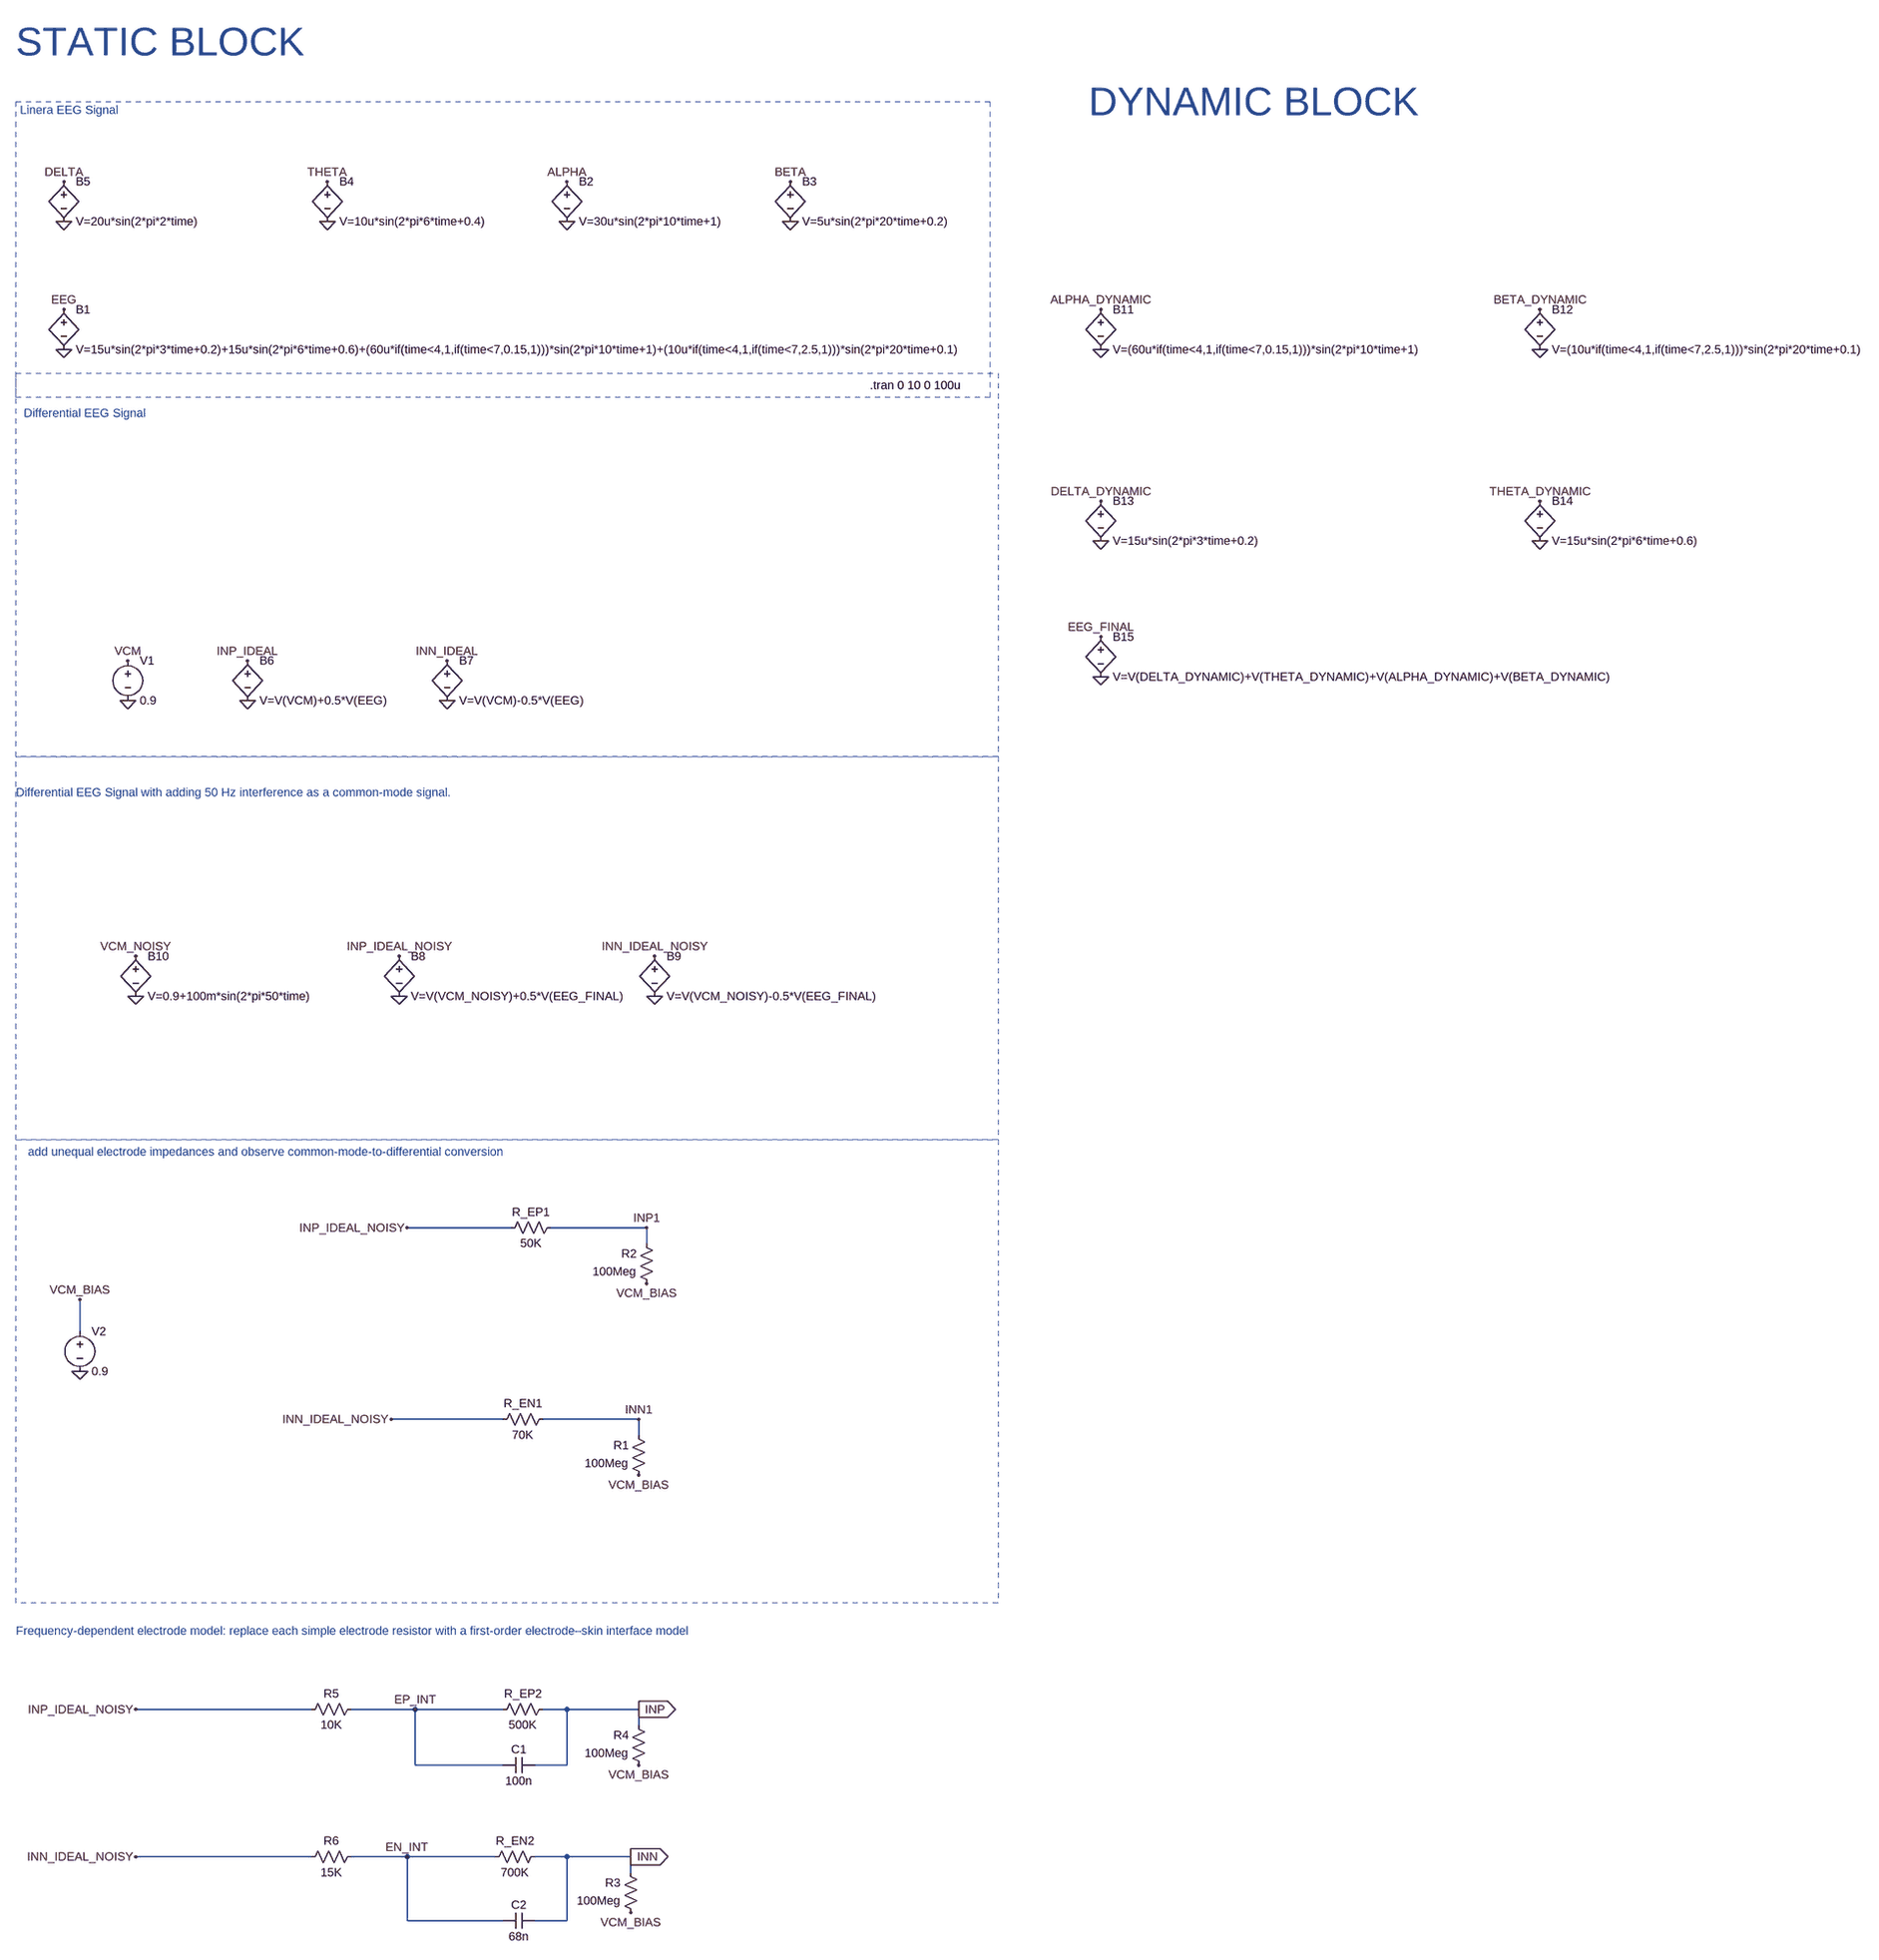
[diagram p0: schematic EEG_INPUT_MODEL.asc]
EEG_INPUT_MODEL.asc, the LTspice schematic file:
Version 4.1
SHEET 1 880 1832
WIRE -4880 112 -5088 112
WIRE -4608 112 -4800 112
WIRE -4608 144 -4608 112
WIRE -5744 320 -5744 256
WIRE -4896 496 -5120 496
WIRE -4624 496 -4816 496
WIRE -4624 528 -4624 496
WIRE -5280 1152 -5632 1152
WIRE -5072 1152 -5200 1152
WIRE -4896 1152 -5072 1152
WIRE -4768 1152 -4816 1152
WIRE -4624 1152 -4768 1152
WIRE -4624 1184 -4624 1152
WIRE -5072 1264 -5072 1152
WIRE -4896 1264 -5072 1264
WIRE -4768 1264 -4768 1152
WIRE -4768 1264 -4832 1264
WIRE -5280 1536 -5632 1536
WIRE -5088 1536 -5200 1536
WIRE -4912 1536 -5088 1536
WIRE -4768 1536 -4832 1536
WIRE -4640 1536 -4768 1536
WIRE -4640 1568 -4640 1536
WIRE -5088 1664 -5088 1536
WIRE -4896 1664 -5088 1664
WIRE -4768 1664 -4768 1536
WIRE -4768 1664 -4832 1664
FLAG -5776 -1648 0
FLAG -5776 -1728 EEG
FLAG -4768 -1904 0
FLAG -4768 -1984 ALPHA
FLAG -4320 -1904 0
FLAG -4320 -1984 BETA
FLAG -5248 -1904 0
FLAG -5248 -1984 THETA
FLAG -5776 -1904 0
FLAG -5776 -1984 DELTA
FLAG -5648 -944 0
FLAG -5648 -1024 VCM
FLAG -5408 -944 0
FLAG -5408 -1024 INP_IDEAL
FLAG -5008 -944 0
FLAG -5008 -1024 INN_IDEAL
FLAG -5104 -352 0
FLAG -5104 -432 INP_IDEAL_NOISY
FLAG -4592 -352 0
FLAG -4592 -432 INN_IDEAL_NOISY
FLAG -5632 -352 0
FLAG -5632 -432 VCM_NOISY
FLAG -5088 112 INP_IDEAL_NOISY
FLAG -5120 496 INN_IDEAL_NOISY
FLAG -5744 400 0
FLAG -5744 256 VCM_BIAS
FLAG -4608 112 INP1
FLAG -4624 496 INN1
FLAG -4608 224 VCM_BIAS
FLAG -4624 608 VCM_BIAS
FLAG -5632 1152 INP_IDEAL_NOISY
FLAG -5632 1536 INN_IDEAL_NOISY
FLAG -4624 1152 INP
IOPIN -4624 1152 Out
FLAG -4640 1536 INN
IOPIN -4640 1536 Out
FLAG -4624 1264 VCM_BIAS
FLAG -4640 1648 VCM_BIAS
FLAG -5072 1152 EP_INT
FLAG -5088 1536 EN_INT
FLAG -2656 -1648 0
FLAG -2656 -1728 ALPHA_DYNAMIC
FLAG -1776 -1648 0
FLAG -1776 -1728 BETA_DYNAMIC
FLAG -2656 -1264 0
FLAG -2656 -1344 DELTA_DYNAMIC
FLAG -1776 -1264 0
FLAG -1776 -1344 THETA_DYNAMIC
FLAG -2656 -992 0
FLAG -2656 -1072 EEG_FINAL
SYMBOL bv -5776 -1744 R0
SYMATTR InstName B1
SYMATTR Value V=15u*sin(2*pi*3*time+0.2)+15u*sin(2*pi*6*time+0.6)+(60u*if(time<4,1,if(time<7,0.15,1)))*sin(2*pi*10*time+1)+(10u*if(time<4,1,if(time<7,2.5,1)))*sin(2*pi*20*time+0.1)
SYMBOL bv -4768 -2000 R0
SYMATTR InstName B2
SYMATTR Value V=30u*sin(2*pi*10*time+1)
SYMBOL bv -4320 -2000 R0
SYMATTR InstName B3
SYMATTR Value V=5u*sin(2*pi*20*time+0.2)
SYMBOL bv -5248 -2000 R0
SYMATTR InstName B4
SYMATTR Value V=10u*sin(2*pi*6*time+0.4)
SYMBOL bv -5776 -2000 R0
SYMATTR InstName B5
SYMATTR Value V=20u*sin(2*pi*2*time)
SYMBOL voltage -5648 -1040 R0
WINDOW 123 0 0 Left 0
WINDOW 39 0 0 Left 0
SYMATTR InstName V1
SYMATTR Value 0.9
SYMBOL bv -5408 -1040 R0
SYMATTR InstName B6
SYMATTR Value V=V(VCM)+0.5*V(EEG)
SYMBOL bv -5008 -1040 R0
SYMATTR InstName B7
SYMATTR Value V=V(VCM)-0.5*V(EEG)
SYMBOL bv -5104 -448 R0
SYMATTR InstName B8
SYMATTR Value V=V(VCM_NOISY)+0.5*V(EEG_FINAL)
SYMBOL bv -4592 -448 R0
SYMATTR InstName B9
SYMATTR Value V=V(VCM_NOISY)-0.5*V(EEG_FINAL)
SYMBOL bv -5632 -448 R0
SYMATTR InstName B10
SYMATTR Value V=0.9+100m*sin(2*pi*50*time)
SYMBOL res -4784 96 R90
WINDOW 0 0 56 VBottom 2
WINDOW 3 32 56 VTop 2
SYMATTR InstName R_EP1
SYMATTR Value 50K
SYMBOL res -4800 480 R90
WINDOW 0 0 56 VBottom 2
WINDOW 3 32 56 VTop 2
SYMATTR InstName R_EN1
SYMATTR Value 70K
SYMBOL voltage -5744 304 R0
WINDOW 123 0 0 Left 0
WINDOW 39 0 0 Left 0
SYMATTR InstName V2
SYMATTR Value 0.9
SYMBOL res -4608 624 R180
WINDOW 0 36 76 Left 2
WINDOW 3 36 40 Left 2
SYMATTR InstName R1
SYMATTR Value 100Meg
SYMBOL res -4592 240 R180
WINDOW 0 36 76 Left 2
WINDOW 3 36 40 Left 2
SYMATTR InstName R2
SYMATTR Value 100Meg
SYMBOL res -4800 1136 R90
WINDOW 0 0 56 VBottom 2
WINDOW 3 32 56 VTop 2
SYMATTR InstName R_EP2
SYMATTR Value 500K
SYMBOL res -4816 1520 R90
WINDOW 0 0 56 VBottom 2
WINDOW 3 32 56 VTop 2
SYMATTR InstName R_EN2
SYMATTR Value 700K
SYMBOL res -4624 1664 R180
WINDOW 0 36 76 Left 2
WINDOW 3 36 40 Left 2
SYMATTR InstName R3
SYMATTR Value 100Meg
SYMBOL res -4608 1280 R180
WINDOW 0 36 76 Left 2
WINDOW 3 36 40 Left 2
SYMATTR InstName R4
SYMATTR Value 100Meg
SYMBOL res -5184 1136 R90
WINDOW 0 0 56 VBottom 2
WINDOW 3 32 56 VTop 2
SYMATTR InstName R5
SYMATTR Value 10K
SYMBOL res -5184 1520 R90
WINDOW 0 0 56 VBottom 2
WINDOW 3 32 56 VTop 2
SYMATTR InstName R6
SYMATTR Value 15K
SYMBOL cap -4832 1248 R90
WINDOW 0 0 32 VBottom 2
WINDOW 3 32 32 VTop 2
SYMATTR InstName C1
SYMATTR Value 100n
SYMBOL cap -4832 1648 R90
WINDOW 0 0 32 VBottom 2
WINDOW 3 32 32 VTop 2
SYMATTR InstName C2
SYMATTR Value 68n
SYMBOL bv -2656 -1744 R0
SYMATTR InstName B11
SYMATTR Value V=(60u*if(time<4,1,if(time<7,0.15,1)))*sin(2*pi*10*time+1)
SYMBOL bv -1776 -1744 R0
SYMATTR InstName B12
SYMATTR Value V=(10u*if(time<4,1,if(time<7,2.5,1)))*sin(2*pi*20*time+0.1)
SYMBOL bv -2656 -1360 R0
SYMATTR InstName B13
SYMATTR Value V=15u*sin(2*pi*3*time+0.2)
SYMBOL bv -1776 -1360 R0
SYMATTR InstName B14
SYMATTR Value V=15u*sin(2*pi*6*time+0.6)
SYMBOL bv -2656 -1088 R0
SYMATTR InstName B15
SYMATTR Value V=V(DELTA_DYNAMIC)+V(THETA_DYNAMIC)+V(ALPHA_DYNAMIC)+V(BETA_DYNAMIC)
TEXT -4160 -1576 Left 2 !.tran 0 10 0 100u
TEXT -5864 -2128 Left 2 ;Linera EEG Signal
TEXT -5856 -1520 Left 2 ;Differential EEG Signal
TEXT -5872 -760 Left 2 ;Differential EEG Signal with adding 50 Hz interference as a common-mode signal.
TEXT -5848 -40 Left 2 ;add unequal electrode impedances and observe common-mode-to-differential conversion
TEXT -5872 920 Left 2 ;Frequency-dependent electrode model: replace each simple electrode resistor with a first-order electrode–skin interface model
TEXT -2680 -2144 Left 6 ;DYNAMIC BLOCK
TEXT -5872 -2264 Left 6 ;STATIC BLOCK
RECTANGLE Normal -3920 -1552 -5872 -2144 2
RECTANGLE Normal -3904 -832 -5872 -1600 2
RECTANGLE Normal -3904 -64 -5872 -832 2
RECTANGLE Normal -3904 864 -5872 -64 2

The netlist it stands for:
* EEG_INPUT_MODEL.asc
B1 EEG 0 V=15u*sin(2*pi*3*time+0.2)+15u*sin(2*pi*6*time+0.6)+(60u*if(time<4,1,if(time<7,0.15,1)))*sin(2*pi*10*time+1)+(10u*if(time<4,1,if(time<7,2.5,1)))*sin(2*pi*20*time+0.1)
B2 ALPHA 0 V=30u*sin(2*pi*10*time+1)
B3 BETA 0 V=5u*sin(2*pi*20*time+0.2)
B4 THETA 0 V=10u*sin(2*pi*6*time+0.4)
B5 DELTA 0 V=20u*sin(2*pi*2*time)
V1 VCM 0 0.9
B6 INP_IDEAL 0 V=V(VCM)+0.5*V(EEG)
B7 INN_IDEAL 0 V=V(VCM)-0.5*V(EEG)
B8 INP_IDEAL_NOISY 0 V=V(VCM_NOISY)+0.5*V(EEG_FINAL)
B9 INN_IDEAL_NOISY 0 V=V(VCM_NOISY)-0.5*V(EEG_FINAL)
B10 VCM_NOISY 0 V=0.9+100m*sin(2*pi*50*time)
R_EP1 INP1 INP_IDEAL_NOISY 50K
R_EN1 INN1 INN_IDEAL_NOISY 70K
V2 VCM_BIAS 0 0.9
R1 VCM_BIAS INN1 100Meg
R2 VCM_BIAS INP1 100Meg
R_EP2 INP EP_INT 500K
R_EN2 INN EN_INT 700K
R3 VCM_BIAS INN 100Meg
R4 VCM_BIAS INP 100Meg
R5 EP_INT INP_IDEAL_NOISY 10K
R6 EN_INT INN_IDEAL_NOISY 15K
C1 INP EP_INT 100n
C2 INN EN_INT 68n
B11 ALPHA_DYNAMIC 0 V=(60u*if(time<4,1,if(time<7,0.15,1)))*sin(2*pi*10*time+1)
B12 BETA_DYNAMIC 0 V=(10u*if(time<4,1,if(time<7,2.5,1)))*sin(2*pi*20*time+0.1)
B13 DELTA_DYNAMIC 0 V=15u*sin(2*pi*3*time+0.2)
B14 THETA_DYNAMIC 0 V=15u*sin(2*pi*6*time+0.6)
B15 EEG_FINAL 0 V=V(DELTA_DYNAMIC)+V(THETA_DYNAMIC)+V(ALPHA_DYNAMIC)+V(BETA_DYNAMIC)
.tran 0 10 0 100u
* Linera EEG Signal
* Differential EEG Signal
* Differential EEG Signal with adding 50 Hz interference as a common-mode signal.
* add unequal electrode impedances and observe common-mode-to-differential conversion
* Frequency-dependent electrode model: replace each simple electrode resistor with a first-order electrode–skin interface model
* DYNAMIC BLOCK
* STATIC BLOCK
.backanno
.end

* Results of the author's LTspice run, read from the files saved beside the schematic
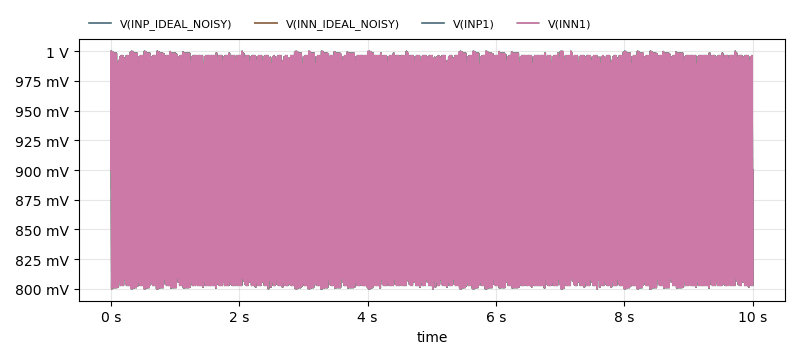
[diagram p1: Transient Analysis of EEG_INPUT_MODEL.asc, plotted from the saved traces]
* Transient Analysis, 1 run:
*   V(INP_IDEAL_NOISY): min 800 mV, max 1 V, average 899.9 mV, rms 902.6 mV, last 900 mV
*   V(INN_IDEAL_NOISY): min 800 mV, max 1 V, average 899.9 mV, rms 902.6 mV, last 900 mV
*   V(INP1): min 800 mV, max 1 V, average 899.9 mV, rms 902.6 mV, last 900 mV
*   V(INN1): min 800.1 mV, max 999.9 mV, average 899.9 mV, rms 902.6 mV, last 900 mV